# Altium project NodeMCU1.0.PrjPcb
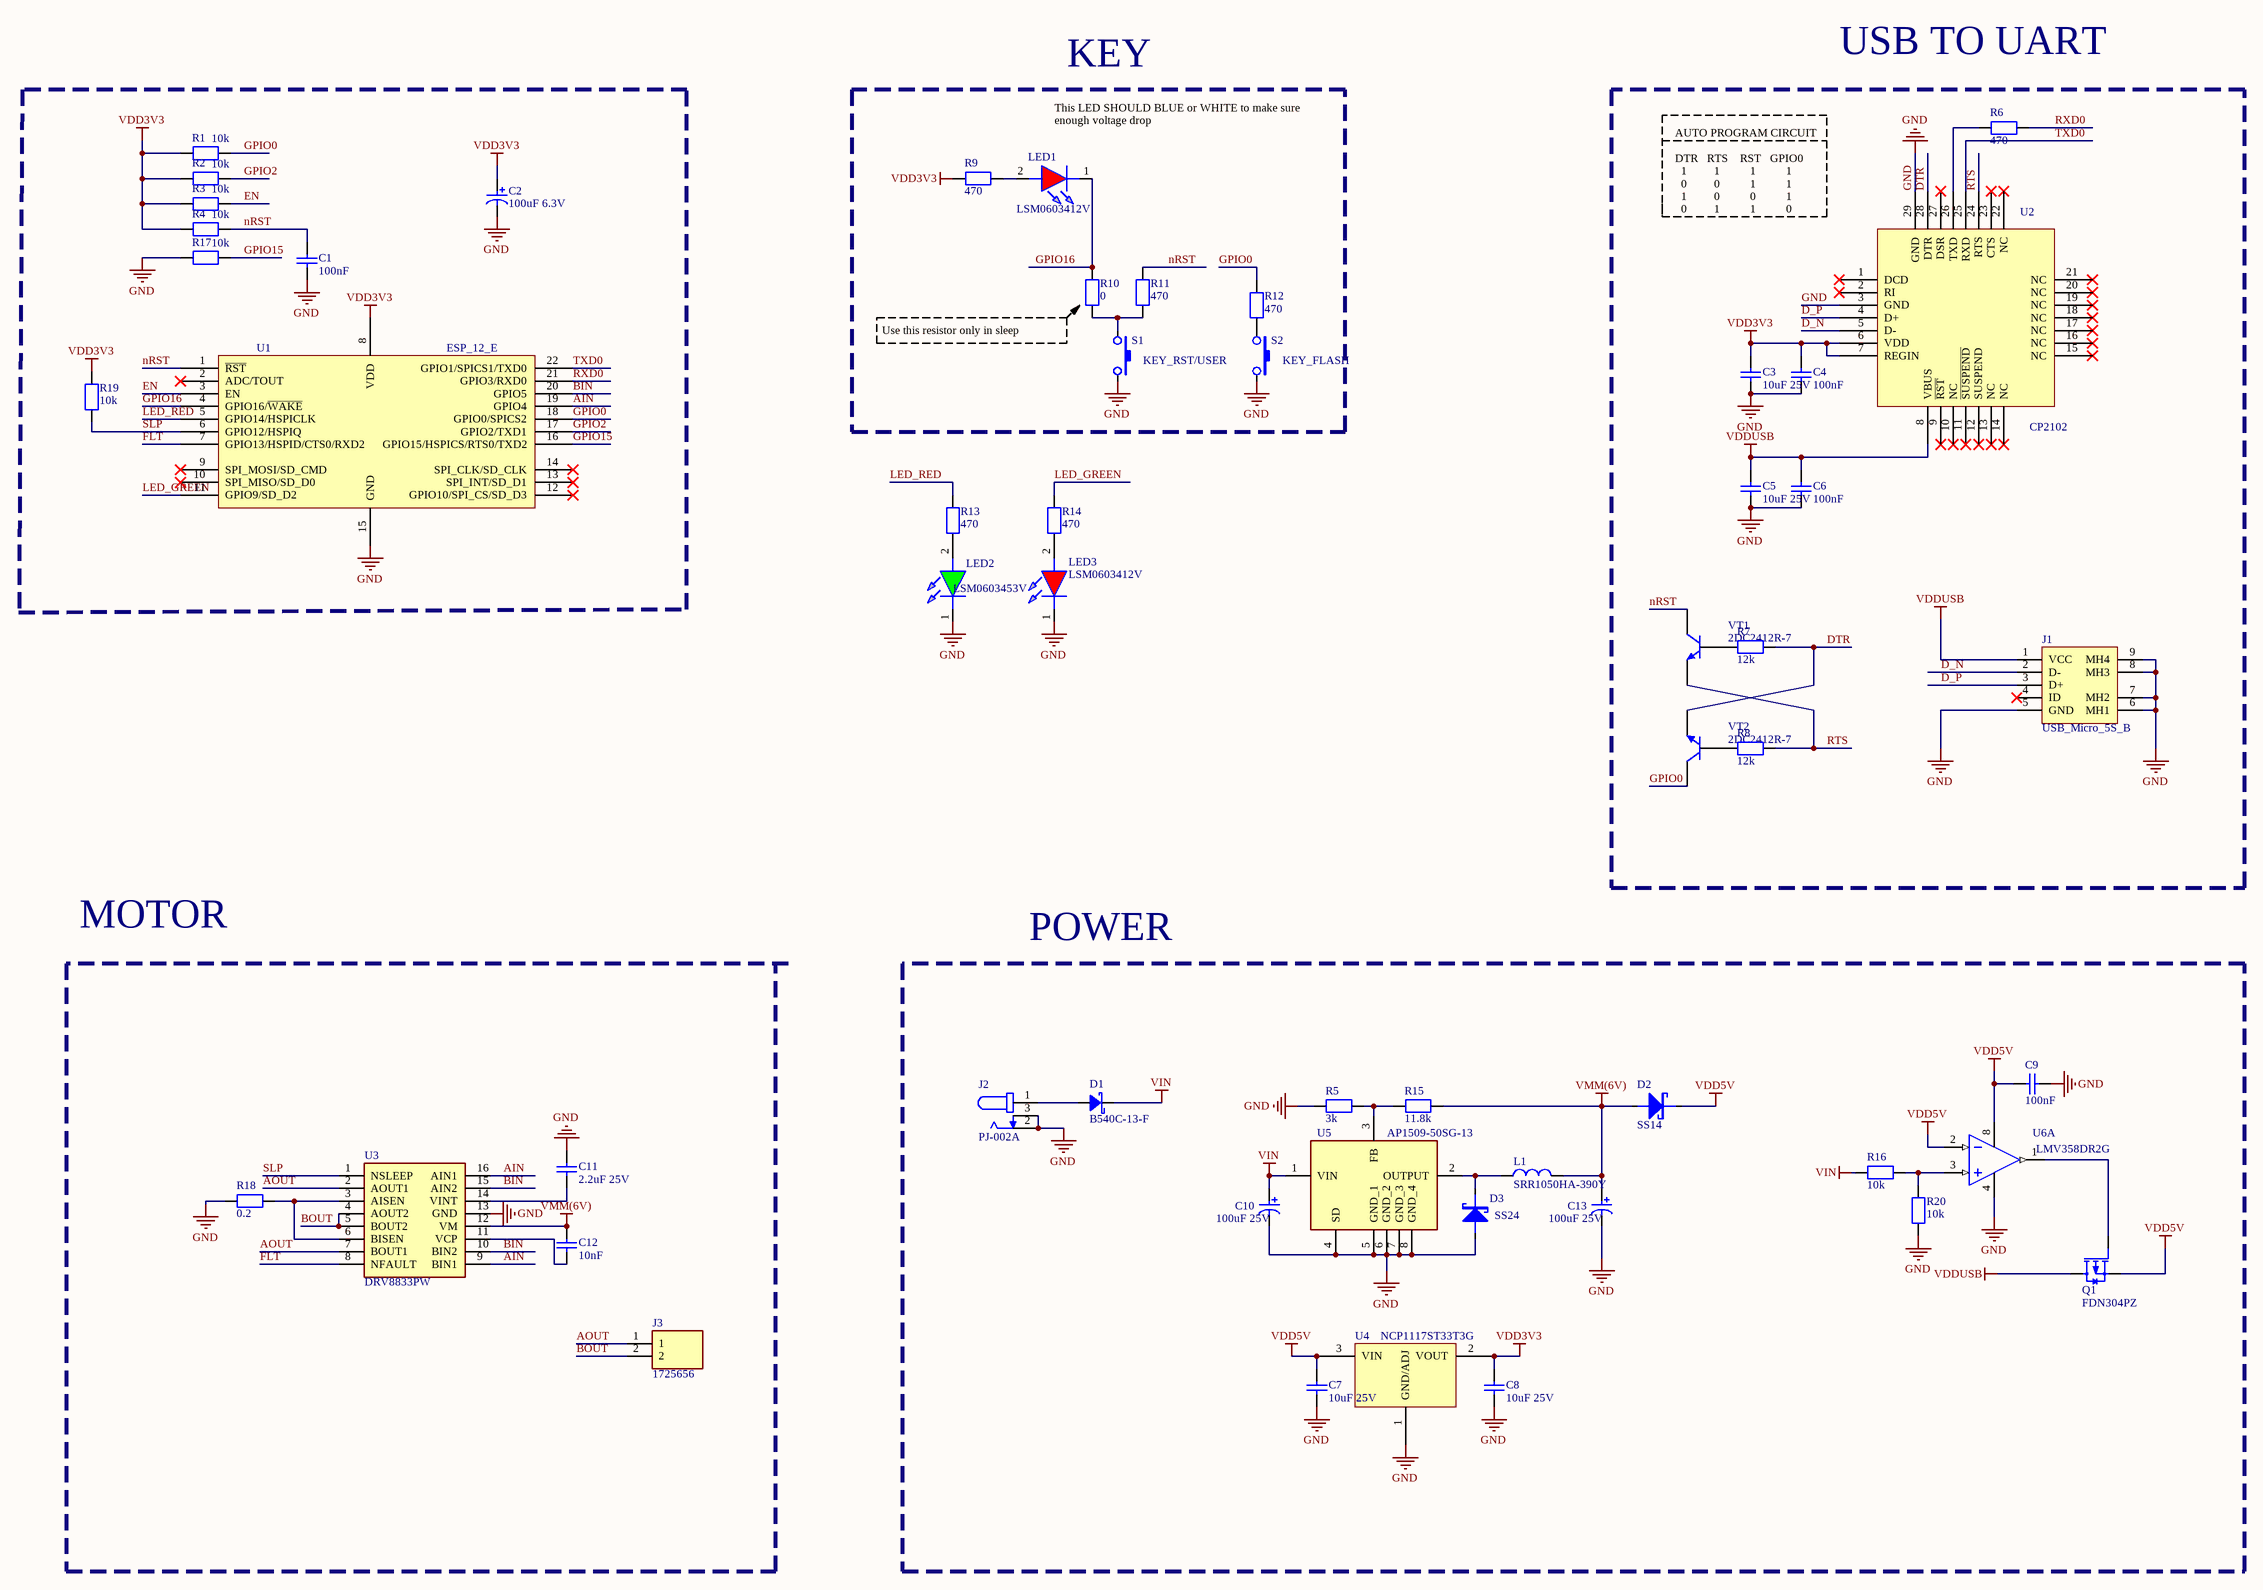
[diagram p0: NodeMCU1.0.SchDoc]
1 sheet, 54 parts. Net scope: global (net labels, ports and power ports of the same name join across sheets).
Board file: NodeMCU1.0.PcbDoc

## Sheet NodeMCU1.0.SchDoc: ESP-12 CORE
size A2; Date: 20/11/2014; Author: HuangRui <vowstar@gmail.com>; DrawnBy: JiYaping <jyp1817@gmail.com>; Organization: WWW.NODEMCU.COM; SheetNumber: 1; SheetTotal: 1

### Parts
C1  100nF  [SMT_C_0603]
C2  100uF 6.3V  [SMT_C_Tantalum_B]
C3  10uF 25V  [SMT_C_0603]
C4  100nF  [SMT_C_0603]
C5  10uF 25V  [SMT_C_0603]
C6  100nF  [SMT_C_0603]
C7  10uF 25V  [SMT_C_0805]
C8  10uF 25V  [SMT_C_0603]
C9  100nF  [SMT_C_0603]
C10  100uF 25V  [CAPPRD250W50D630H1250]
C11  2.2uF 25V  [SMT_C_0603]
C12  10nF  [SMT_C_0603]
C13  100uF 25V  [CAPPRD250W50D630H1250]
D1  B540C-13-F  [B540C-13-F]
D2  SS14  [SS14]
D3  SS24  [DIOM5436X247N]
J1  USB_Micro_5S_B  [USB_MICRO_5S_B]
J2  PJ-002A  [PJ002A]
J3  1725656  [1725656]
L1  SRR1050HA-390Y  [INDPM102100X510N]
LED1  LSM0603412V  [LSM0603412V]
LED2  LSM0603453V  [LEDC1608X55N]
LED3  LSM0603412V  [LSM0603412V]
Q1  FDN304PZ  [SOT95P251X112-3N]
R1  10k  [SMT_R_0603]
R2  10k  [SMT_R_0603]
R3  10k  [SMT_R_0603]
R4  10k  [SMT_R_0603]
R5  3k  [SMT_R_0603]
R6  470  [SMT_R_0603]
R7  12k  [SMT_R_0603]
R8  12k  [SMT_R_0603]
R9  470  [SMT_R_0603]
R10  0  [SMT_R_0603]
R11  470  [SMT_R_0603]
R12  470  [SMT_R_0603]
R13  470  [SMT_R_0603]
R14  470  [SMT_R_0603]
R15  11.8k  [SMT_R_0603]
R16  10k  [SMT_R_0603]
R17  10k  [SMT_R_0603]
R18  0.2  [RESC5025X65N]
R19  10k  [SMT_R_0603]
R20  10k  [SMT_R_0603]
S1  KEY_RST/USER  [SMT_SW_PTS_820]
S2  KEY_FLASH  [SMT_SW_PTS_820]
U1  ESP_12_E  [ESP_12_E_L]
U2  CP2102  [CP2102]
U3  DRV8833PW  [DRV8833PW]
U4  NCP1117ST33T3G  [SOT-223]
U5  AP1509-50SG-13  [SOIC127P600X175-8N]
U6  LMV358DR2G  [SOIC127P600X175-8N]  (part A of 2)
VT1  2DC2412R-7  [SMT_TRIODE_NPN]
VT2  2DC2412R-7  [SMT_TRIODE_NPN]

### Blocks framed on the sheet
KEY: LED1 R9-R12 S1 S2
POWER: C7-C10 C13 D1-D3 J2 L1 Q1 R5 R15 R16 R20 U4-U6

### Nets
GND: C1.1 C2.2 C3.1 C4.1 C5.1 C6.1 C7.1 C8.1 C9.2 C10.2 C11.1 C13.2 D3.2(A) J1.5(GND) J1.6(MH1) J1.7(MH2) J1.8(MH3) J1.9(MH4) J2.2 J2.3 LED2.1(K) LED3.1(K) R5.1 R17.1 R18.1 R20.1 S1.2 S2.2 U1.15(GND) U2.3(GND) U2.29(GND) U3.13(GND) U4.1(GND/ADJ) U5.4(SD) U5.5(GND_1) U5.6(GND_2) U5.7(GND_3) U5.8(GND_4) U6.4(V-)
VDD3V3: C2.1 C3.2 C4.2 C8.2 R1.1 R2.1 R3.1 R4.1 R9.2 R19.2 U1.8(VDD) U2.6(VDD) U2.7(REGIN) U4.2(VOUT)
VDD5V: C7.2 C9.1 D2.1(K) Q1.2(S) U4.3(VIN) U6.2(IN_A-) U6.8(V+)
VDDUSB: C5.2 C6.2 J1.1(VCC) Q1.3(D) U2.8(VBUS)
VIN: C10.1 D1.K R16.2 U5.1(VIN)
VMM(6V): C12.2 C13.1 D2.2(A) L1.2 R15.2 U3.12(VM)
AIN: U1.19(GPIO4) U3.9(BIN1) U3.16(AIN1)
AOUT: J3.1 U3.2(AOUT1) U3.7(BOUT1)
BIN: U1.20(GPIO5) U3.10(BIN2) U3.15(AIN2)
BOUT: J3.2 U3.4(AOUT2) U3.5(BOUT2)
D_N: J1.2(D-) U2.5(D-)
D_P: J1.3(D+) U2.4(D+)
DTR: R7.2 U2.28(DTR) VT2.2(E)
EN: R3.2 U1.3(EN)
FLT: U1.7(GPIO13/HSPID/CTS0/RXD2) U3.8(NFAULT)
GPIO0: R1.2 R12.2 U1.18(GPIO0/SPICS2) VT2.3(C)
GPIO2: R2.2 U1.17(GPIO2/TXD1)
GPIO15: R17.2 U1.16(GPIO15/HSPICS/RTS0/TXD2)
GPIO16: LED1.1(K) R10.2 U1.4(GPIO16/~{WAKE})
LED_GREEN: R14.1 U1.11(GPIO9/SD_D2)
LED_RED: R13.1 U1.5(GPIO14/HSPICLK)
nRST: C1.2 R4.2 R11.2 U1.1(~{RST}) VT1.3(C)
RTS: R8.2 U2.24(RTS) VT1.2(E)
RXD0: R6.2 U1.21(GPIO3/RXD0)
SLP: R19.1 U1.6(GPIO12/HSPIQ) U3.1(NSLEEP)
TXD0: U1.22(GPIO1/SPICS1/TXD0) U2.25(RXD)
NetC11_2: C11.2 U3.14(VINT)
NetC12_1: C12.1 U3.11(VCP)
NetD1_A: D1.A J2.1
NetD3_1: D3.1(K) L1.1 U5.2(OUTPUT)
NetLED1_2: LED1.2(A) R9.1
NetLED2_2: LED2.2(A) R13.2
NetLED3_2: LED3.2(A) R14.2
NetQ1_1: Q1.1(G) U6.1(OUT_A)
NetR5_2: R5.2 R15.1 U5.3(FB)
NetR6_1: R6.1 U2.26(TXD)
NetR7_1: R7.1 VT1.1(B)
NetR8_1: R8.1 VT2.1(B)
NetR10_1: R10.1 R11.1 S1.1
NetR12_1: R12.1 S2.1
NetR16_1: R16.1 R20.2 U6.3(IN_A+)
NetR18_2: R18.2 U3.3(AISEN) U3.6(BISEN)

Not connected (* = marked no-connect by the designer): J1 4(ID)*; U1 2(ADC/TOUT)* 9(SPI_MOSI/SD_CMD)* 10(SPI_MISO/SD_D0)* 12(GPIO10/SPI_CS/SD_D3)* 13(SPI_INT/SD_D1)* 14(SPI_CLK/SD_CLK)*; U2 1(DCD)* 2(RI)* 9(~{RST})* 10(NC)* 11(~{SUSPEND})* 12(SUSPEND)* 13(NC)* 14(NC)* 15(NC)* 16(NC)* 17(NC)* 18(NC)* 19(NC)* 20(NC)* 21(NC)* 22(NC)* 23(CTS)* 27(DSR)*

### Notes on the sheet
- USB TO UART
- (near LED1) This LED SHOULD BLUE or WHITE to make sure enough voltage drop
- AUTO PROGRAM CIRCUIT
  DTR   RTS    RST   GPIO0
  1         1          1          1
  0         0          1          1
  1         0          0          1
  0         1          1          0
- Use this resistor only in sleep mode
- MOTOR

### Library data of the parts
C1 C4 C6 C9 = SMT CAP 100nF 50V(0603): Multilayer Ceramic Capacitors MLCC - SMD/SMT 50V 100nF X7R 0603 10%; Manufacturer: Yageo; Manufacturer Part Number: CS0603KRX7R9BB104; Value: 100nF; Supplier: mouser; Supplier Part Number: 603-CS0603KRX79BB104; Price: 0.1
C2 = SMT ECAP 100uF(SMT_C): Tantalum Capacitors - Solid SMD 6.3V 100uF 1210 ESR=1.7Ohms 20%; Manufacturer Part Number: TAJB107M006RNJ; Manufacturer: KYOCERA AVX; Supplier Part Number: 581-TAJB107M006R; Supplier: Mouser; Value: 100uF 6.3V; Price: 0.47
C3 C5 C8 = SMT CAP 10uF 25V(0603): Multilayer Ceramic Capacitors MLCC - SMD/SMT 25 V 10 uF X5R 0603 20%; Manufacturer Part Number: CC0603MRX5R8BB106; Manufacturer: YAGEO; Supplier Part Number: 603-CC0603MRX58BB106; Supplier: Mouser; Value: 10uF 25V; Price: 0.6
C7 = SMT CAP 10uF 25V(0805): Multilayer Ceramic Capacitors MLCC - SMD/SMT 25 V 10 uF X6S 0805 10%; Manufacturer Part Number: CC0805KKX6S8BB106; Manufacturer: YAGEO; Supplier Part Number: 603-CC0805KX6S8BB106; Supplier: Mouser; Value: 10uF 25V; Price: 0.5
C10 C13 = ECAP 100uF 25V: Aluminium Electrolytic Capacitors - Radial Leaded 25V 100uF 85C 2k Hour Radial; Manufacturer: Kemet; Manufacturer Part Number: ESK107M025AE3AA; Value: 100uF 25V; Supplier: mouser; Supplier Part Number: 80-ESK107M025AE3AA; Price: 0.24
C11 = SMT CAP 2.2uF 25V(0603): Multilayer Ceramic Capacitors MLCC - SMD/SMT 25 V 2.2 uF X5R 0603 20%; Manufacturer Part Number: CC0603MRX5R8BB225; Manufacturer: YAGEO; Supplier Part Number: 603-CC0603MRX58BB225; Supplier: Mouser; Value: 2.2uF 25V; Price: 0.6
C12 = SMT CAP 10nF 50V(0603): Multilayer Ceramic Capacitors MLCC - SMD/SMT 50V 10nF X7R 0603 10%; Manufacturer: Yageo; Manufacturer Part Number: CS0603KRX7R9BB103; Value: 10nF; Supplier: mouser; Supplier Part Number: 603-CS0603KRX79BB103; Price: 0.1
D1 = DIODE 10TQ035: DIODE SCHOTTKY 40V 5A SMC; Manufacturer: Diodes; Value: B540C-13-F; Manufacturer Part Number: B540C-13-F; Supplier: Mouser; Supplier Part Number: 621-B540C-F; Price: 0.5
D2 = SS14: Schottky Diodes & Rectifiers SMA 40V 1.0A; Manufacturer: onsemi / Fairchild; Manufacturer Part Number: SS14; Supplier Part Number: 512-SS14; Supplier: Mouser; Value: SS14; Price: 0.38
D3 = SS24: Schottky Diodes & Rectifiers 2A, 40V, Schottky Rectifier; Manufacturer: Taiwan Semiconductor; Manufacturer Part Number: SS24; Supplier Part Number: 821-SS24; Supplier: Mouser; Value: SS24; Price: 0.38
J1 = USB_Micro_5S_B: USB micro female SMT with 4 fixed foot; Manufacturer Part Number: 614105150721; Manufacturer: Wurth Electronics; Value: 614105150721; Supplier Part Number: 710-614105150721; Supplier: Mouser; Price: 2
J2 = PJ-002A: CONN PWR JACK 2X5.5MM SOLDER; Manufacturer: CUI Devices; Supplier Part Number: 490-PJ-002A; Supplier: Mouser; Manufacturer Part Number: PJ-002A; Value: PJ-002A; Price: 0.7
J3 = 1725656: PCB terminal block, nominal current: 6 A, rated voltage (III/2): 160 V, nominal cross section: 0.5 mm?, Number of potentials: 2, Number of rows: 1, Number of positions per row: 2, product range: MPT 0,5, pitch: 2.54 mm, connection method: Screw connection with tension sleeve, mounting: Wave soldering, conductor/PCB connection direction: 0 ?, color: green, Pin layout: Linear pinning, Solder pin [P]: 3.5 mm, type of packaging: packed in cardboard; Manufacturer: Phoenix Contact; Supplier Part Number: 651-1725656; Supplier: Mouser; Manufacturer Part Number: 1725656; Value: 1725656; Price: 1.96
L1 = INDUCTOR 39uH 2.25A: Ind,10x10.2x4.8mm,39uH+/-30%,2.25A,shd; Manufacturer: Bourns; Supplier Part Number: 652-SRR1050HA-390Y; Supplier: Mouser; Manufacturer Part Number: SRR1050HA-390Y; Value: 39uH 2.25A; Price: 1.44
LED1 LED3 = LSM0603412V: Standard LEDs - SMD SMD 0603 2V 100mcd RED; Manufacturer: Visual Communications Company; Supplier Part Number: 593-LSM0603412V; Supplier: Mouser; Manufacturer Part Number: LSM0603412V; Value: LSM0603412V; Price: 0.4
LED2 = LSM0603453V: Standard LEDs - SMD SMD 0603 3V 1000mcd GREEN; Manufacturer: Visual Communications Company; Supplier Part Number: 593-LSM0603453V; Supplier: Mouser; Manufacturer Part Number: LSM0603453V; Price: 0.4; Value: LSM0603453V
Q1 = MOSFET-P: P-Channel MOSFET; Manufacturer: onsemi / Fairchild; Supplier Part Number: 512-FDN304PZ; Supplier: Mouser; Manufacturer Part Number: FDN304PZ; Value: FDN304PZ; Price: 0.6
R1-R4 R16 R17 R19 R20 = RES 10K 0.1W 1%: Thick Film Resistors - SMD 10 kOhms 100mW 0603 1%; Manufacturer: Yageo; Manufacturer Part Number: RC0603FR-0710KL; Value: 10k; Supplier: Mouser; Supplier Part Number: 603-RC0603FR-0710KL; Price: 0.1
R5 = RES 3K 0.1W 1%: Thick Film Resistors - SMD 3 kOhms 100mW 0603 1%; Manufacturer: Yageo; Manufacturer Part Number: RC0603FR-073KL; Value: 3k; Supplier: Mouser; Supplier Part Number: 603-RC0603FR-073KL; Price: 0.1
R6 R9 R11-R14 = RES 470 0.1W 1%: Thick Film Resistors - SMD 470 Ohms 100mW 0603 1%; Manufacturer: Yageo; Manufacturer Part Number: RC0603FR-07470RL; Value: 470; Supplier: Mouser; Price: 0.1
  R6: Supplier Part Number: 603-RC0603FR-07470RL
  R9 R11-R14: Supplier Part Number: 603-RC0603FR-071KL
R7 R8 = RES 12K 0.1W 1%: Thick Film Resistors - SMD 12 kOhms 100mW 0603 1%; Manufacturer: Yageo; Manufacturer Part Number: RC0603FR-0712KL; Value: 12k; Supplier: Mouser; Supplier Part Number: 603-RC0603FR-0712KL; Price: 0.1
R10 = RES 0 0.1W 1%: Thick Film Resistors - SMD 0 Ohms 100mW 0603 1%; Manufacturer: Yageo; Manufacturer Part Number: RC0603FR-070RL; Value: 0; Supplier: Mouser; Supplier Part Number: 603-RC0603FR-070RL; Price: 0.1
R15 = RES 11.8K 0.1W 1%: Thick Film Resistors - SMD 11.8 kOhms 100mW 0603 1%; Manufacturer: Yageo; Manufacturer Part Number: RC0603FR-0711K8L; Value: 11.8k; Supplier: Mouser; Supplier Part Number: 603-RC0603FR-0711K8L; Price: 0.1
R18 = RES 0.2 0.75W 5%: Current Sense Resistors 200 mOhms 750mW 5 % 600 ppm/C AEC-Q200; Manufacturer: Yageo; Manufacturer Part Number: RL2010JK-070R2L; Value: 0.2; Supplier: Mouser; Supplier Part Number: 603-RL2010JK-070R2L; Price: 0.65
S1 S2 = SMT SW PTS_820: SMT Tactile ‎Switch PTS 820 Series; Manufacturer Part Number: PTS820J25MSMTRLFS; Manufacturer: C&K; Value: SMT SW; Supplier Part Number: 611-PTS820J25MSMTR; Supplier: Mouser; Price: 0.4
U1 = ESP_12_E: ESP-12 Wi-Fi Module by AI-Thinker; Manufacturer Part Number: ESP-12E; Manufacturer: china; Value: ESP-12E; Price: 1.46
U2 = CP2102: USB Interface IC USBXpress - USB to UART Bridge QFN28; Manufacturer Part Number: CP2102N-A02-GQFN28; Manufacturer: Silicon Labs; Value: CP2102N-A02-GQFN28; Supplier Part Number: 634-CP2102NA02GQFN28; Supplier: Mouser; Price: 3.75
U3 = DRV8833PW: Motor / Motion / Ignition Controllers & Drivers DRV8833 EVAL MOD; Manufacturer: Texas Instruments; Supplier Part Number: 595-DRV8833PW; Supplier: Mouser; Manufacturer Part Number: DRV8833PW; Price: 2.76; Value: DRV8833PW
U4 = NCP1117: LDO Voltage Regulators 3.3V 1A Positive; Manufacturer: onsemi; Manufacturer Part Number: NCP1117ST33T3G; Supplier Part Number: 863-NCP1117ST33T3G; Supplier: Mouser; Value: NCP1117ST33T3G; Price: 0.68
U5 = AP1509-50SG-13: DiodesZetex, AP1509-50SG-13 DC-DC Converter 2A 8-Pin, SOP; Manufacturer: Diodes Inc.; Supplier Part Number: 621-AP1509-50SG-13; Supplier: Mouser; Manufacturer Part Number: AP1509-50SG-13; Price: 1.2; Value: AP1509-50SG-13
U6 = LMV358DR2G: Operational Amplifiers - Op Amps LV R2R DUAL OP AMP; Manufacturer: onsemi; Supplier Part Number: 863-LMV358DR2G; Supplier: Mouser; Manufacturer Part Number: LMV358DR2G; Price: 0.6; Value: LMV358DR2G
VT1 VT2 = SMT_TRIODE_NPN: Bipolar Transistors - BJT 50V NPN SMT; Manufacturer: Diodes Incorporated; Manufacturer Part Number: 2DC2412R-7; Supplier Part Number: 621-2DC2412R-7; Supplier: Mouser; Value: 2DC2412R-7; Price: 0.4